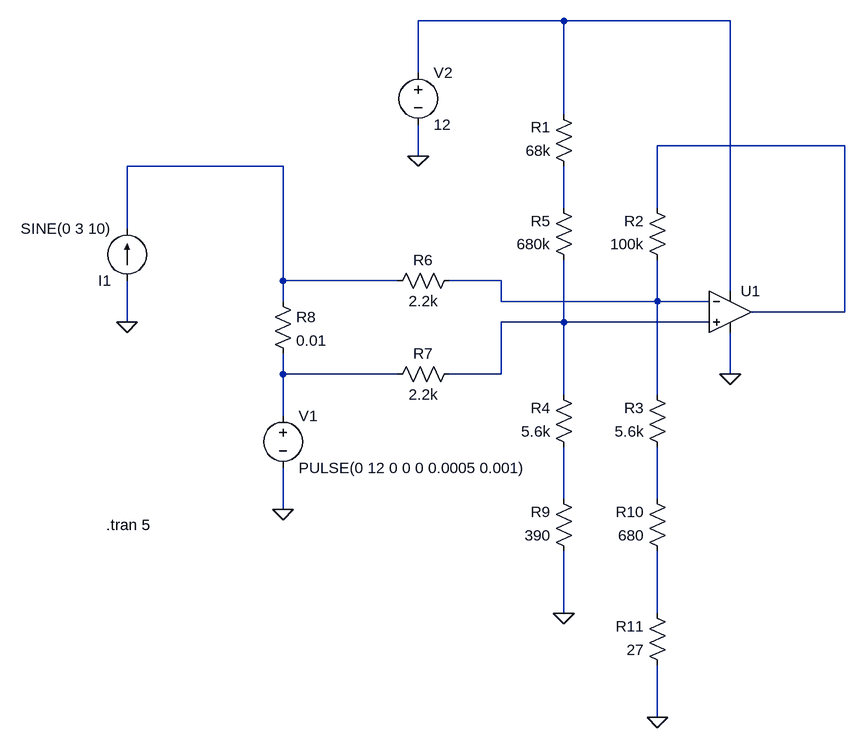
[diagram p0: schematic I_sense_hi_V_concept_03.asc]
I_sense_hi_V_concept_03.asc, the LTspice schematic file:
Version 4
SHEET 1 1060 820
WIRE 0 -272 -224 -272
WIRE 256 -272 0 -272
WIRE -224 -192 -224 -272
WIRE 0 -128 0 -272
WIRE 432 -80 144 -80
WIRE -224 -64 -224 -112
WIRE -432 -48 -672 -48
WIRE 0 16 0 -48
WIRE 144 16 144 -80
WIRE -672 48 -672 -48
WIRE -432 128 -432 -48
WIRE -256 128 -432 128
WIRE -96 128 -176 128
WIRE 256 144 256 -272
WIRE -432 160 -432 128
WIRE -96 160 -96 128
WIRE 144 160 144 96
WIRE 144 160 -96 160
WIRE 224 160 144 160
WIRE 432 176 432 -80
WIRE 432 176 288 176
WIRE -672 192 -672 128
WIRE 0 192 0 96
WIRE 0 192 -96 192
WIRE 224 192 0 192
WIRE -432 272 -432 240
WIRE -256 272 -432 272
WIRE -96 272 -96 192
WIRE -96 272 -176 272
WIRE 256 272 256 208
WIRE 0 304 0 192
WIRE 144 304 144 160
WIRE -432 336 -432 272
WIRE 0 464 0 384
WIRE 144 464 144 384
WIRE -432 480 -432 416
WIRE 0 640 0 544
WIRE 144 640 144 544
WIRE 144 800 144 720
FLAG -432 480 0
FLAG 0 640 0
FLAG 144 800 0
FLAG 256 272 0
FLAG -224 -64 0
FLAG -672 192 0
SYMBOL res 160 112 R180
WINDOW 0 36 76 Left 2
WINDOW 3 36 40 Left 2
SYMATTR InstName R2
SYMATTR Value 100k
SYMBOL res 160 400 R180
WINDOW 0 36 76 Left 2
WINDOW 3 36 40 Left 2
SYMATTR InstName R3
SYMATTR Value 5.6k
SYMBOL res 16 400 R180
WINDOW 0 36 76 Left 2
WINDOW 3 36 40 Left 2
SYMATTR InstName R4
SYMATTR Value 5.6k
SYMBOL res 16 112 R180
WINDOW 0 36 76 Left 2
WINDOW 3 36 40 Left 2
SYMATTR InstName R5
SYMATTR Value 680k
SYMBOL res -272 144 R270
WINDOW 0 32 56 VTop 2
WINDOW 3 0 56 VBottom 2
SYMATTR InstName R6
SYMATTR Value 2.2k
SYMBOL res -272 288 R270
WINDOW 0 32 56 VTop 2
WINDOW 3 0 56 VBottom 2
SYMATTR InstName R7
SYMATTR Value 2.2k
SYMBOL res -448 144 R0
SYMATTR InstName R8
SYMATTR Value 0.01
SYMBOL voltage -432 320 R0
WINDOW 123 0 0 Left 0
WINDOW 39 0 0 Left 0
SYMATTR InstName V1
SYMATTR Value PULSE(0 12 0 0 0 0.0005 0.001)
SYMBOL voltage -224 -208 R0
WINDOW 123 0 0 Left 0
WINDOW 39 0 0 Left 0
SYMATTR InstName V2
SYMATTR Value 12
SYMBOL current -672 128 R180
WINDOW 123 0 0 Left 0
WINDOW 39 0 0 Left 0
SYMATTR InstName I1
SYMATTR Value SINE(0 3 10)
SYMBOL OpAmps\\UniversalOpAmp1 256 176 R0
SYMATTR InstName U1
SYMBOL res 16 -32 R180
WINDOW 0 36 76 Left 2
WINDOW 3 36 40 Left 2
SYMATTR InstName R1
SYMATTR Value 68k
SYMBOL res 16 560 R180
WINDOW 0 36 76 Left 2
WINDOW 3 36 40 Left 2
SYMATTR InstName R9
SYMATTR Value 390
SYMBOL res 160 560 R180
WINDOW 0 36 76 Left 2
WINDOW 3 36 40 Left 2
SYMATTR InstName R10
SYMATTR Value 680
SYMBOL res 160 736 R180
WINDOW 0 36 76 Left 2
WINDOW 3 36 40 Left 2
SYMATTR InstName R11
SYMATTR Value 27
TEXT -704 504 Left 2 !.tran 5

The netlist it stands for:
* I_sense_hi_V_concept_03.asc
R2 N005 N002 100k
R3 N009 N005 5.6k
R4 N008 N006 5.6k
R5 N006 N004 680k
R6 N003 N005 2.2k
R7 N007 N006 2.2k
R8 N003 N007 0.01
V1 N007 0 PULSE(0 12 0 0 0 0.0005 0.001)
V2 N001 0 12
I1 0 N003 SINE(0 3 10)
XU1 N006 N005 N001 0 N002 level1 Avol=1Meg GBW=10Meg Vos=0 En=0 Enk=0 In=0 Ink=0 Rin=500Meg  ; pins In+ In- V+ V- OUT
R1 N004 N001 68k
R9 0 N008 390
R10 N010 N009 680
R11 0 N010 27
.tran 5
.lib UniversalOpAmp1.lib
.backanno
.end